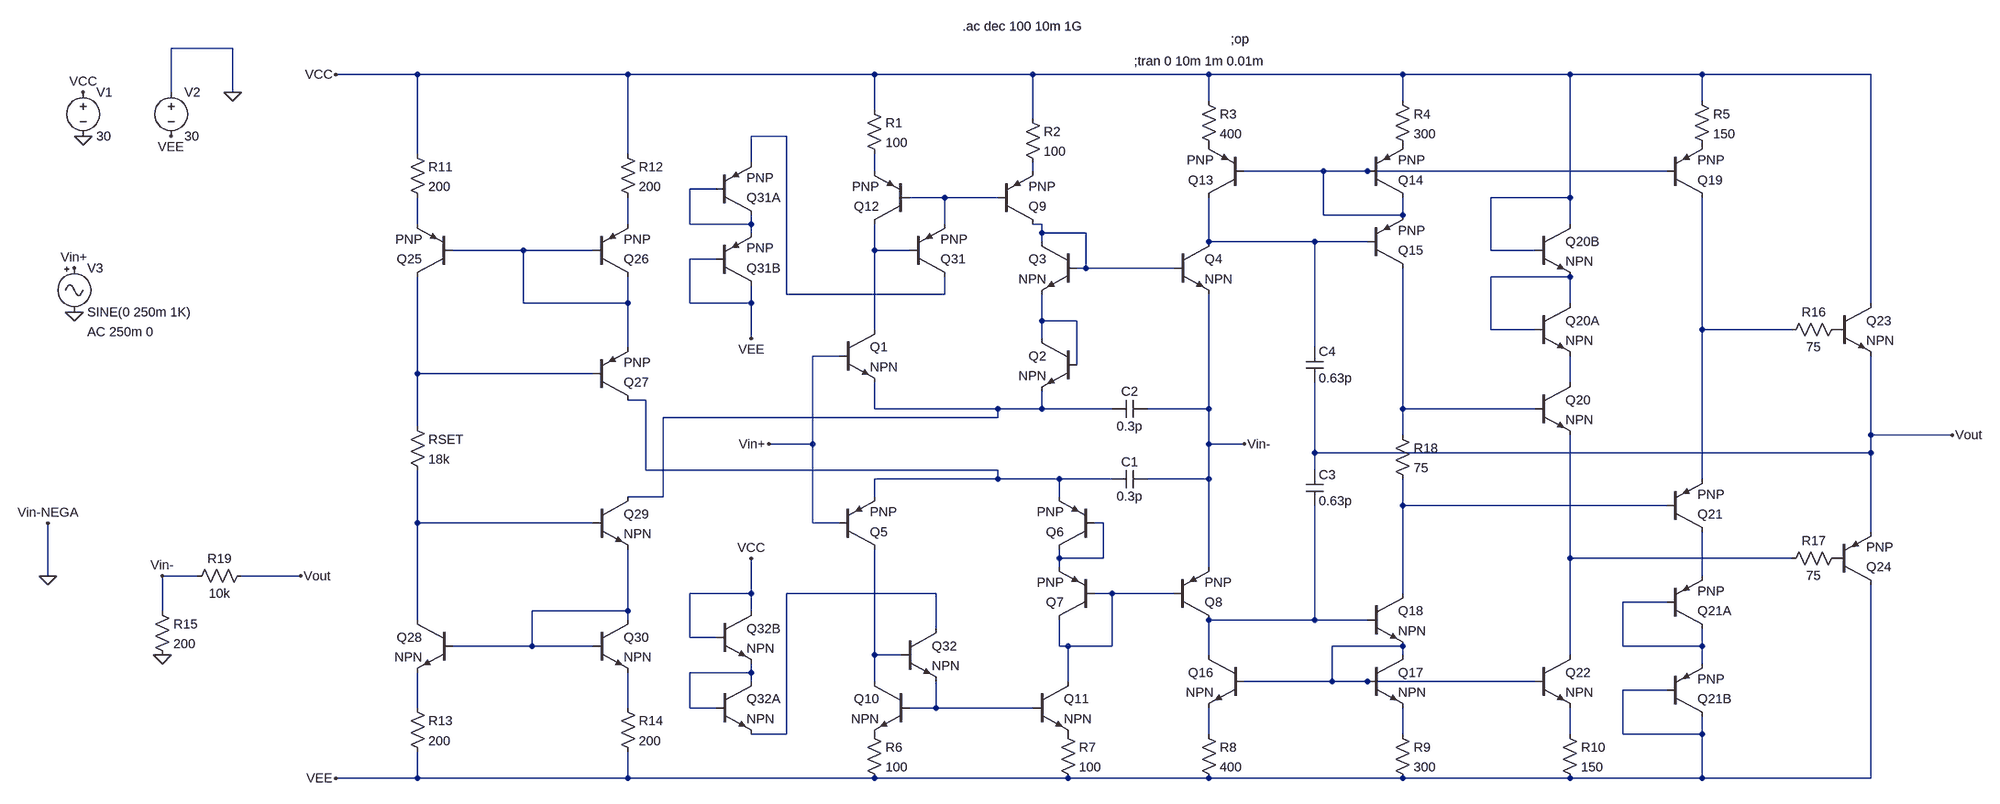
[diagram p0: schematic CircuitoCompleto.asc]
CircuitoCompleto.asc, the LTspice schematic file:
Version 4
SHEET 1 2600 1252
WIRE -912 -288 -1024 -288
WIRE -416 -240 -688 -240
WIRE -32 -240 -416 -240
WIRE 416 -240 -32 -240
WIRE 704 -240 416 -240
WIRE 1024 -240 704 -240
WIRE 1376 -240 1024 -240
WIRE 1680 -240 1376 -240
WIRE 1920 -240 1680 -240
WIRE 2272 -240 1920 -240
WIRE -1024 -208 -1024 -288
WIRE -912 -208 -912 -288
WIRE 1024 -192 1024 -240
WIRE 1376 -192 1376 -240
WIRE 1920 -192 1920 -240
WIRE 416 -176 416 -240
WIRE 704 -160 704 -240
WIRE 256 -128 192 -128
WIRE -416 -96 -416 -240
WIRE -32 -96 -32 -240
WIRE 192 -80 192 -128
WIRE 416 -64 416 -96
WIRE 704 -64 704 -80
WIRE 1232 -64 1088 -64
WIRE 1312 -64 1232 -64
WIRE 1856 -64 1312 -64
WIRE 128 -32 80 -32
WIRE 544 -16 480 -16
WIRE 640 -16 544 -16
WIRE 1680 -16 1680 -240
WIRE 1680 -16 1536 -16
WIRE 1232 16 1232 -64
WIRE 1376 16 1376 -16
WIRE 1376 16 1232 16
WIRE -416 32 -416 -16
WIRE -32 32 -32 -16
WIRE 80 32 80 -32
WIRE 192 32 192 16
WIRE 192 32 80 32
WIRE 544 32 544 -16
WIRE 720 32 704 32
WIRE 1680 32 1680 -16
WIRE 192 48 192 32
WIRE 720 48 720 32
WIRE 800 48 720 48
WIRE 720 64 720 48
WIRE 1024 64 1024 -16
WIRE 1216 64 1024 64
WIRE 1312 64 1216 64
WIRE -224 80 -352 80
WIRE -96 80 -224 80
WIRE 416 80 416 32
WIRE 480 80 416 80
WIRE 1536 80 1536 -16
WIRE 1616 80 1536 80
WIRE 128 96 80 96
WIRE 800 112 800 48
WIRE 800 112 784 112
WIRE 960 112 800 112
WIRE 1680 128 1536 128
WIRE 256 160 256 -128
WIRE 544 160 544 128
WIRE 544 160 256 160
WIRE -224 176 -224 80
WIRE -32 176 -32 128
WIRE -32 176 -224 176
WIRE 80 176 80 96
WIRE 192 176 192 144
WIRE 192 176 80 176
WIRE 1680 176 1680 128
WIRE 2272 176 2272 -240
WIRE 720 208 720 160
WIRE 784 208 720 208
WIRE 416 224 416 80
WIRE 1536 224 1536 128
WIRE 1616 224 1536 224
WIRE 1920 224 1920 -16
WIRE 2128 224 1920 224
WIRE 192 240 192 176
WIRE 720 240 720 208
WIRE -32 256 -32 176
WIRE 1216 256 1216 64
WIRE 352 272 304 272
WIRE 784 288 784 208
WIRE -416 304 -416 128
WIRE -96 304 -416 304
WIRE 1680 320 1680 272
WIRE 0 352 -32 352
WIRE 416 368 416 320
WIRE 640 368 416 368
WIRE 720 368 720 336
WIRE 720 368 640 368
WIRE 848 368 720 368
WIRE 1024 368 1024 160
WIRE 1024 368 912 368
WIRE 1376 368 1376 112
WIRE 1616 368 1376 368
WIRE 640 384 640 368
WIRE 640 384 32 384
WIRE -416 400 -416 304
WIRE 1376 416 1376 368
WIRE 2272 416 2272 272
WIRE 2528 416 2272 416
WIRE 304 432 304 272
WIRE 304 432 224 432
WIRE 1024 432 1024 368
WIRE 1088 432 1024 432
WIRE 1216 448 1216 320
WIRE 2272 448 2272 416
WIRE 2272 448 1216 448
WIRE 0 480 0 352
WIRE 640 480 0 480
WIRE 1216 480 1216 448
WIRE 640 496 640 480
WIRE 640 496 416 496
WIRE 752 496 640 496
WIRE 848 496 752 496
WIRE 1024 496 1024 432
WIRE 1024 496 912 496
WIRE 1920 496 1920 224
WIRE 32 528 32 384
WIRE 32 528 -32 528
WIRE 416 528 416 496
WIRE 752 528 752 496
WIRE 1376 544 1376 496
WIRE 1856 544 1376 544
WIRE -416 576 -416 480
WIRE -96 576 -416 576
WIRE 304 576 304 432
WIRE 352 576 304 576
WIRE 832 576 816 576
WIRE 2272 592 2272 448
WIRE 752 640 752 624
WIRE 832 640 832 576
WIRE 832 640 752 640
WIRE 1680 640 1680 416
WIRE 2128 640 1680 640
WIRE 752 656 752 640
WIRE 1024 656 1024 496
WIRE -1248 672 -1248 576
WIRE -976 672 -1040 672
WIRE -752 672 -896 672
WIRE 1920 672 1920 592
WIRE 192 704 192 640
WIRE 192 704 80 704
WIRE 528 704 256 704
WIRE 848 704 816 704
WIRE 960 704 848 704
WIRE 1376 704 1376 544
WIRE 1856 720 1776 720
WIRE -1040 736 -1040 672
WIRE -32 736 -32 624
WIRE -32 736 -208 736
WIRE 192 736 192 704
WIRE -416 752 -416 576
WIRE -32 752 -32 736
WIRE 1216 752 1216 544
WIRE 1216 752 1024 752
WIRE 1312 752 1216 752
WIRE 528 768 528 704
WIRE 80 784 80 704
WIRE 128 784 80 784
WIRE -208 800 -208 736
WIRE -208 800 -352 800
WIRE -96 800 -208 800
WIRE 752 800 752 752
WIRE 768 800 752 800
WIRE 848 800 848 704
WIRE 848 800 768 800
WIRE 1376 800 1248 800
WIRE 1776 800 1776 720
WIRE 1920 800 1920 768
WIRE 1920 800 1776 800
WIRE 416 816 416 624
WIRE 464 816 416 816
WIRE 1024 816 1024 752
WIRE 1376 816 1376 800
WIRE 1680 816 1680 640
WIRE 1920 832 1920 800
WIRE 192 848 192 832
WIRE 192 848 80 848
WIRE 192 864 192 848
WIRE 416 864 416 816
WIRE 768 864 768 800
WIRE 1248 864 1248 800
WIRE 1248 864 1088 864
WIRE 1312 864 1248 864
WIRE 1616 864 1312 864
WIRE 1856 880 1776 880
WIRE -416 912 -416 848
WIRE -32 912 -32 848
WIRE 80 912 80 848
WIRE 128 912 80 912
WIRE 528 912 528 864
WIRE 528 912 480 912
WIRE 704 912 528 912
WIRE 256 960 256 704
WIRE 256 960 192 960
WIRE 1024 960 1024 912
WIRE 1376 960 1376 912
WIRE 1680 960 1680 912
WIRE 1776 960 1776 880
WIRE 1920 960 1920 928
WIRE 1920 960 1776 960
WIRE -416 1040 -416 992
WIRE -416 1040 -688 1040
WIRE -32 1040 -32 992
WIRE -32 1040 -416 1040
WIRE 416 1040 -32 1040
WIRE 768 1040 416 1040
WIRE 1024 1040 768 1040
WIRE 1376 1040 1024 1040
WIRE 1680 1040 1376 1040
WIRE 1920 1040 1920 960
WIRE 1920 1040 1680 1040
WIRE 2272 1040 2272 688
WIRE 2272 1040 1920 1040
FLAG -688 1040 VEE
FLAG -688 -240 VCC
FLAG 224 432 Vin+
FLAG 192 240 VEE
FLAG 192 640 VCC
FLAG 1088 432 Vin-
FLAG -1248 672 0
FLAG -1248 576 Vin-NEGA
FLAG -1184 -208 VCC
FLAG -1184 -128 0
FLAG -912 -208 0
FLAG -1024 -128 VEE
FLAG -1200 192 0
FLAG -1200 112 Vin+
FLAG 2528 416 Vout
FLAG -1040 816 0
FLAG -1040 672 Vin-
FLAG -752 672 Vout
DATAFLAG 896 112 ""
DATAFLAG 1040 432 ""
DATAFLAG 288 432 ""
DATAFLAG 1024 368 ""
DATAFLAG 1024 368 ""
DATAFLAG 1024 368 ""
DATAFLAG 2272 400 ""
SYMBOL npn -352 752 M0
SYMATTR InstName Q28
SYMBOL npn -96 752 R0
SYMATTR InstName Q30
SYMBOL res -432 896 R0
SYMATTR InstName R13
SYMATTR Value 200
SYMBOL res -48 896 R0
SYMATTR InstName R14
SYMATTR Value 200
SYMBOL res -432 384 R0
SYMATTR InstName RSET
SYMATTR Value 18k
SYMBOL res -432 -112 R0
SYMATTR InstName R11
SYMATTR Value 200
SYMBOL res -48 -112 R0
SYMATTR InstName R12
SYMATTR Value 200
SYMBOL pnp -352 128 R180
SYMATTR InstName Q25
SYMBOL pnp -96 128 M180
SYMATTR InstName Q26
SYMBOL pnp -96 352 M180
SYMATTR InstName Q27
SYMBOL npn -96 528 R0
SYMATTR InstName Q29
SYMBOL npn 352 224 R0
SYMATTR InstName Q1
SYMBOL npn 784 240 M0
SYMATTR InstName Q2
SYMBOL npn 784 64 M0
SYMATTR InstName Q3
SYMBOL npn 480 864 M0
SYMATTR InstName Q10
SYMBOL npn 464 768 R0
SYMATTR InstName Q32
SYMBOL npn 704 864 R0
SYMATTR InstName Q11
SYMBOL pnp 480 32 R180
SYMATTR InstName Q12
SYMBOL pnp 640 32 M180
SYMATTR InstName Q9
SYMBOL pnp 480 128 M180
SYMATTR InstName Q31
SYMBOL pnp 352 624 M180
SYMATTR InstName Q5
SYMBOL pnp 816 624 R180
SYMATTR InstName Q6
SYMBOL pnp 816 752 R180
SYMATTR InstName Q7
SYMBOL res 400 -192 R0
SYMATTR InstName R1
SYMATTR Value 100
SYMBOL res 688 -176 R0
SYMATTR InstName R2
SYMATTR Value 100
SYMBOL res 400 944 R0
SYMATTR InstName R6
SYMATTR Value 100
SYMBOL res 752 944 R0
SYMATTR InstName R7
SYMATTR Value 100
SYMBOL pnp 128 16 M180
SYMATTR InstName Q31A
SYMBOL pnp 128 144 M180
SYMATTR InstName Q31B
SYMBOL npn 128 864 R0
SYMATTR InstName Q32A
SYMBOL npn 128 736 R0
SYMATTR InstName Q32B
SYMBOL cap 912 480 R90
WINDOW 0 0 32 VBottom 2
WINDOW 3 32 32 VTop 2
SYMATTR InstName C1
SYMATTR Value 0.3p
SYMBOL cap 912 352 R90
WINDOW 0 0 32 VBottom 2
WINDOW 3 32 32 VTop 2
SYMATTR InstName C2
SYMATTR Value 0.3p
SYMBOL npn 960 64 R0
SYMATTR InstName Q4
SYMBOL pnp 960 752 M180
SYMATTR InstName Q8
SYMBOL voltage -1184 -224 R0
WINDOW 123 0 0 Left 2
WINDOW 39 0 0 Left 2
SYMATTR InstName V1
SYMATTR Value 30
SYMBOL voltage -1024 -224 R0
SYMATTR InstName V2
SYMATTR Value 30
SYMBOL Misc\\signal -1200 96 R0
WINDOW 123 24 132 Left 2
WINDOW 39 0 0 Left 2
SYMATTR InstName V3
SYMATTR Value SINE(0 250m 1K)
SYMATTR Value2 AC 250m 0
SYMBOL npn 1088 816 M0
SYMATTR InstName Q16
SYMBOL res 1008 944 R0
SYMATTR InstName R8
SYMATTR Value 400
SYMBOL npn 1312 816 R0
SYMATTR InstName Q17
SYMBOL npn 1616 816 R0
SYMATTR InstName Q22
SYMBOL res 1360 944 R0
SYMATTR InstName R9
SYMATTR Value 300
SYMBOL res 1664 944 R0
SYMATTR InstName R10
SYMATTR Value 150
SYMBOL npn 1312 704 R0
SYMATTR InstName Q18
SYMBOL res 1360 400 R0
SYMATTR InstName R18
SYMATTR Value 75
SYMBOL pnp 1312 112 M180
SYMATTR InstName Q15
SYMBOL pnp 1312 -16 M180
SYMATTR InstName Q14
SYMBOL res 1360 -208 R0
SYMATTR InstName R4
SYMATTR Value 300
SYMBOL pnp 1088 -16 R180
SYMATTR InstName Q13
SYMBOL res 1008 -208 R0
SYMATTR InstName R3
SYMATTR Value 400
SYMBOL pnp 1856 -16 M180
SYMATTR InstName Q19
SYMBOL res 1904 -208 R0
SYMATTR InstName R5
SYMATTR Value 150
SYMBOL npn 1616 320 R0
SYMATTR InstName Q20
SYMBOL npn 1616 176 R0
SYMATTR InstName Q20A
SYMBOL npn 1616 32 R0
SYMATTR InstName Q20B
SYMBOL pnp 1856 592 M180
SYMATTR InstName Q21
SYMBOL pnp 1856 768 M180
SYMATTR InstName Q21A
SYMBOL pnp 1856 928 M180
SYMATTR InstName Q21B
SYMBOL res 2224 624 R90
WINDOW 0 0 56 VBottom 2
WINDOW 3 32 56 VTop 2
SYMATTR InstName R17
SYMATTR Value 75
SYMBOL res 2224 208 R90
WINDOW 0 0 56 VBottom 2
WINDOW 3 32 56 VTop 2
SYMATTR InstName R16
SYMATTR Value 75
SYMBOL pnp 2208 688 M180
SYMATTR InstName Q24
SYMBOL npn 2208 176 R0
SYMATTR InstName Q23
SYMBOL cap 1200 480 R0
SYMATTR InstName C3
SYMATTR Value 0.63p
SYMBOL cap 1200 256 R0
SYMATTR InstName C4
SYMATTR Value 0.63p
SYMBOL res -1056 720 R0
SYMATTR InstName R15
SYMATTR Value 200
SYMBOL res -880 656 R90
WINDOW 0 0 56 VBottom 2
WINDOW 3 32 56 VTop 2
SYMATTR InstName R19
SYMATTR Value 10k
TEXT 1064 -304 Left 2 !;op
TEXT 888 -264 Left 2 !;tran 0 10m 1m 0.01m
TEXT 576 -328 Left 2 !.ac dec 100 10m 1G

The netlist it stands for:
* CircuitoCompleto.asc
Q28 N022 N029 N034 0 NPN
Q30 N029 N029 N035 0 NPN
R13 N034 VEE 200
R14 N035 VEE 200
RSET N016 N022 18k
R11 VCC N007 200
R12 VCC N008 200
Q25 N016 N011 N007 0 PNP
Q26 N011 N011 N008 0 PNP
Q27 N018 N016 N011 0 PNP
Q29 N019 N022 N029 0 NPN
Q1 N012 Vin+ N019 0 NPN
Q2 N014 N014 N019 0 NPN
Q3 N009 N009 N014 0 NPN
Q10 N032 N036 P001 0 NPN
Q32 N026 N032 N036 0 NPN
Q11 N027 N036 P002 0 NPN
Q12 N012 N006 N002 0 PNP
Q9 N009 N006 N003 0 PNP
Q31 N001 N012 N006 0 PNP
Q5 N032 Vin+ N018 0 PNP
Q6 N023 N023 N018 0 PNP
Q7 N027 N027 N023 0 PNP
R1 VCC N002 100
R2 VCC N003 100
R6 P001 VEE 100
R7 P002 VEE 100
Q31A N005 N005 N001 0 PNP
Q31B VEE VEE N005 0 PNP
Q32A N033 N033 N026 0 NPN
Q32B VCC VCC N033 0 NPN
C1 Vin- N018 0.3p
C2 Vin- N019 0.3p
Q4 N010 N009 Vin- 0 NPN
Q8 N030 N027 Vin- 0 PNP
V1 VCC 0 30
V2 0 VEE 30
V3 Vin+ 0 SINE(0 250m 1K) AC 250m 0
Q16 N030 N031 N037 0 NPN
R8 N037 VEE 400
Q17 N031 N031 N038 0 NPN
Q22 N024 N031 N039 0 NPN
R9 N038 VEE 300
R10 N039 VEE 150
Q18 N021 N030 N031 0 NPN
R18 N020 N021 75
Q15 N020 N010 N004 0 PNP
Q14 N004 N004 P003 0 PNP
R4 VCC P003 300
Q13 N010 N004 P004 0 PNP
R3 VCC P004 400
Q19 N015 N004 P005 0 PNP
R5 VCC P005 150
Q20 N017 N020 N024 0 NPN
Q20A N013 N013 N017 0 NPN
Q20B VCC VCC N013 0 NPN
Q21 N025 N021 N015 0 PNP
Q21A N028 N028 N025 0 PNP
Q21B VEE VEE N028 0 PNP
R17 P006 N024 75
R16 P007 N015 75
Q24 VEE P006 Vout 0 PNP
Q23 VCC P007 Vout 0 NPN
C3 Vout N030 0.63p
C4 N010 Vout 0.63p
R15 Vin- 0 200
R19 Vout Vin- 10k
.model NPN NPN
.model PNP PNP
.lib standard.bjt
;op
;tran 0 10m 1m 0.01m
.ac dec 100 10m 1G
.backanno
.end